# EAGLE design FreeLSSSMDBoard (EAGLE 6.6.0)
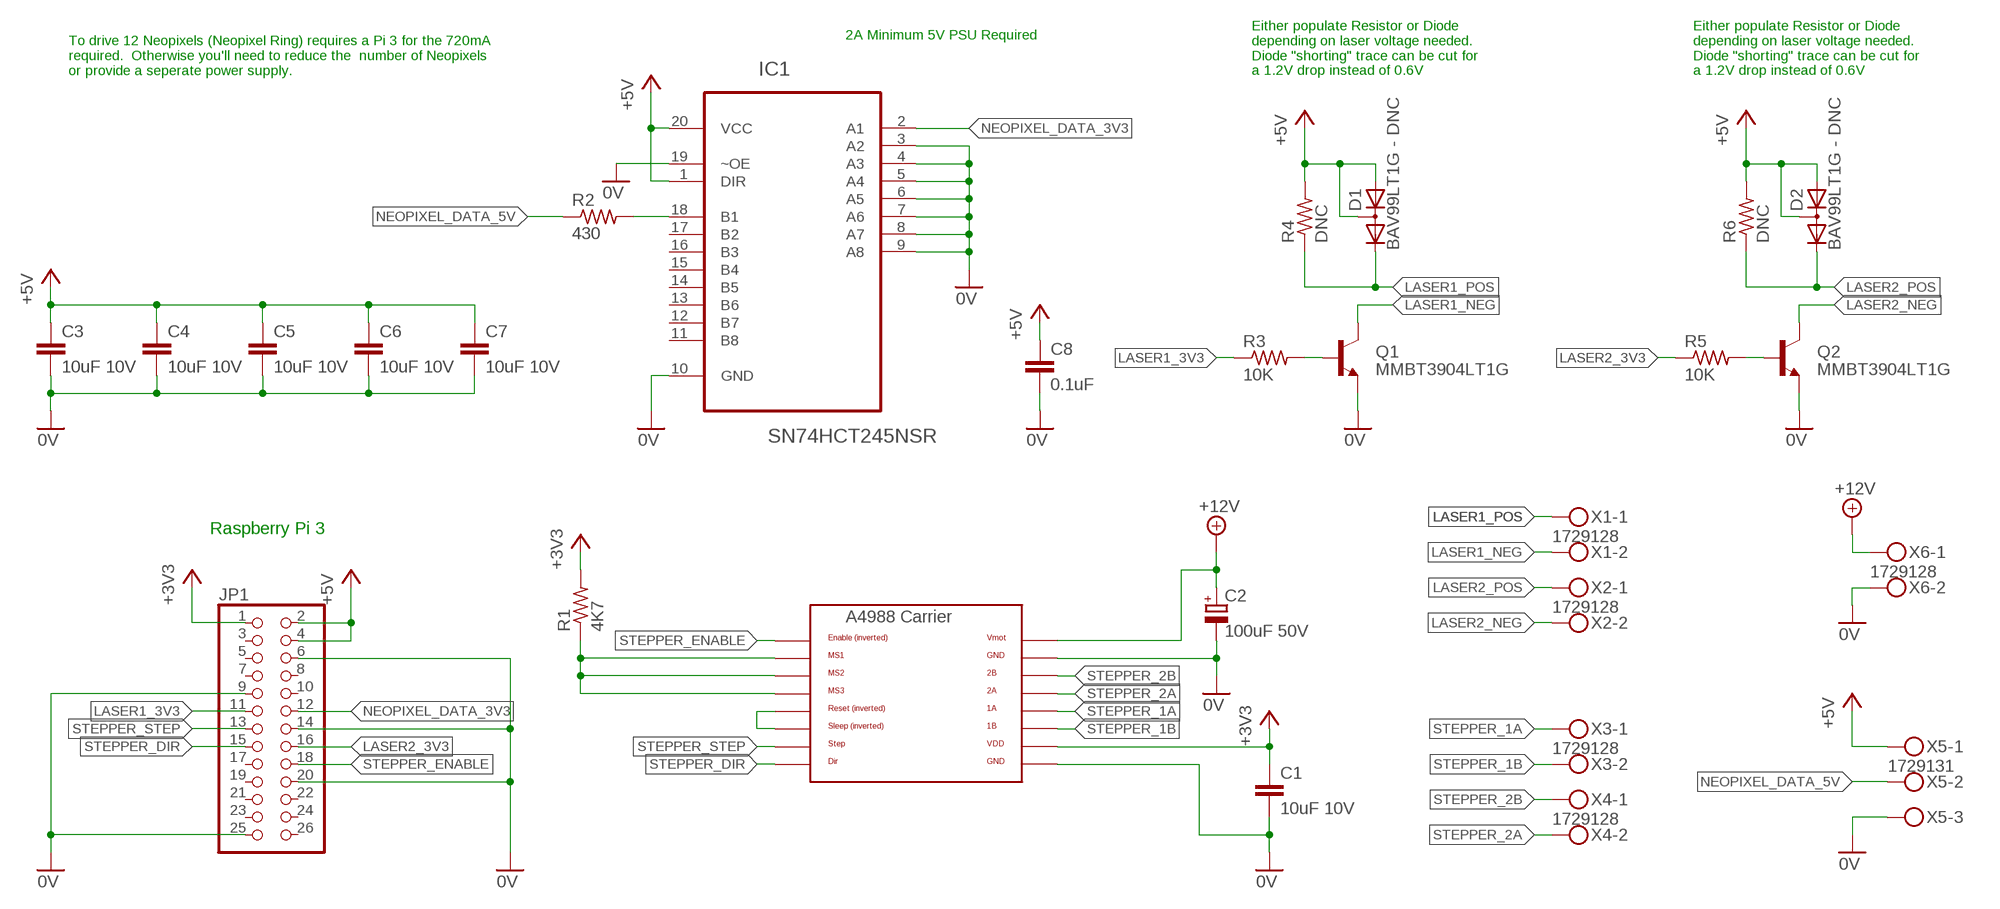
[diagram p0: schematic, sheet 1]

## Parts
C1  10uF 10V  C-EUC0603K  [C0603K]
C2  100uF 50V  CPOL-EUE3.5-8  [E3,5-8]
C3  10uF 10V  C-EUC0603K  [C0603K]
C4  10uF 10V  C-EUC0603K  [C0603K]
C5  10uF 10V  C-EUC0603K  [C0603K]
C6  10uF 10V  C-EUC0603K  [C0603K]
C7  10uF 10V  C-EUC0603K  [C0603K]
C8  0.1uF  C-EUC0603K  [C0603K]
D1  BAV99LT1G - DNC  BAV199  [SOT23]
D2  BAV99LT1G - DNC  BAV199  [SOT23]
IC1  SN74HCT245NSR  [SOP-20]
JP1  PINHD-2X13  [2X13]
Q1  MMBT3904LT1G  [SOT23-BEC]
Q2  MMBT3904LT1G  [SOT23-BEC]
R1  4K7  R-US_R0603  [R0603]
R2  430  R-US_R0603  [R0603]
R3  10K  R-US_R0603  [R0603]
R4  DNC  R-US_R0603  [R0603]
R5  10K  R-US_R0603  [R0603]
R6  DNC  R-US_R0603  [R0603]
U$1  A4988BREAKOUT  [A4988BREAKOUT]
X1  1729128  MKDSN1,5/2-5,08  [MKDSN1,5/2-5,08]
X2  1729128  MKDSN1,5/2-5,08  [MKDSN1,5/2-5,08]
X3  1729128  MKDSN1,5/2-5,08  [MKDSN1,5/2-5,08]
X4  1729128  MKDSN1,5/2-5,08  [MKDSN1,5/2-5,08]
X5  1729131  MKDSN1,5/3-5,08  [MKDSN1,5/3-5,08]
X6  1729128  MKDSN1,5/2-5,08  [MKDSN1,5/2-5,08]

## Nets
0V: C1.2 C2.- C3.2 C4.2 C5.2 C6.2 C7.2 C8.2 IC1.3(A2) IC1.4(A3) IC1.5(A4) IC1.6(A5) IC1.7(A6) IC1.8(A7) IC1.9(A8) IC1.10(GND) IC1.19(~OE) JP1.6 JP1.9 JP1.14 JP1.20 JP1.25 Q1.E Q2.E U$1.GND U$1.GND@0(GND) X5.3 X6.2
+3V3: C1.1 JP1.1 R1.2 U$1.VDD
+5V: C3.1 C4.1 C5.1 C6.1 C7.1 C8.1 D1.1(A) D1.3(AC) D2.1(A) D2.3(AC) IC1.1(DIR) IC1.20(VCC) JP1.2 JP1.4 R4.2 R6.2 X5.1
+12V: C2.+ U$1.VMOT X6.1
LASER1_3V3: JP1.11 R3.1
LASER1_NEG: Q1.C X1.2
LASER1_POS: D1.2(C) R4.1 X1.1
LASER2_3V3: JP1.16 R5.1
LASER2_NEG: Q2.C X2.2
LASER2_POS: D2.2(C) R6.1 X2.1
N$1: U$1.RST U$1.SLP(SLEEP)
N$2: R1.1 U$1.MS1 U$1.MS2 U$1.MS3
N$3: IC1.18(B1) R2.2
N$4: Q1.B R3.2
N$6: Q2.B R5.2
NEOPIXEL_DATA_3V3: IC1.2(A1) JP1.12
NEOPIXEL_DATA_5V: R2.1 X5.2
STEPPER_1A: U$1.1A X3.1
STEPPER_1B: U$1.1B X3.2
STEPPER_2A: U$1.2A X4.2
STEPPER_2B: U$1.2B X4.1
STEPPER_DIR: JP1.15 U$1.DIR
STEPPER_ENABLE: JP1.18 U$1.EN
STEPPER_STEP: JP1.13 U$1.STEP
Unconnected: IC1.11(B8) IC1.12(B7) IC1.13(B6) IC1.14(B5) IC1.15(B4) IC1.16(B3) IC1.17(B2) JP1.3 JP1.5 JP1.7 JP1.8 JP1.10 JP1.17 JP1.19 JP1.21 JP1.22 JP1.23 JP1.24 JP1.26

## Notes on the sheet
- 2A Minimum 5V PSU Required
- To drive 12 Neopixels (Neopixel Ring) requires a Pi 3 for the 720mA
  required.  Otherwise you'll need to reduce the  number of Neopixels
  or provide a seperate power supply.
- Either populate Resistor or Diode
  depending on laser voltage needed.
  Diode "shorting" trace can be cut for
  a 1.2V drop instead of 0.6V
- Either populate Resistor or Diode
  depending on laser voltage needed.
  Diode "shorting" trace can be cut for
  a 1.2V drop instead of 0.6V
- Raspberry Pi 3

## Library data of the parts
C1 C3-C8 = rcl:C-EU: CAPACITOR, European symbol
C2 = rcl:CPOL-EU: POLARIZED CAPACITOR, European symbol
D1 D2 = diode:BAV199: DIODE low-leakage double diode
IC1 = Jetty:SN74HCT245NSR: SN74HCT245NSR Octal Bus Transceivers with 3-State Outputs
JP1 = pinhead:PINHD-2X13: PIN HEADER
Q1 Q2 = 3at:MMBT3904LT1G
R1-R6 = rcl:R-US_: RESISTOR, American symbol
U$1 = RepRapjr:A4988BREAKOUT
X1-X4 X6 = con-phoenix-508:MKDSN1,5/2-5,08: MKDSN 1,5/ 2-5,08 Printklemme Nennstrom: 13,5 A Nennspannung: 250 V Rastermaß: 5,08 mm Polzahl: 2 Anschlussart: Schraubanschluss Montage: Löten Anschlussrichtung Leiter/Platine: 0 ° Artikelnummer: 1729128 Source: http://eshop.phoenixcontact.com .. 1729128.pdf
X5 = con-phoenix-508:MKDSN1,5/3-5,08: MKDSN 1,5/ 3-5,08 Printklemme Nennstrom: 13,5 A Nennspannung: 250 V Rastermaß: 5,08 mm Polzahl: 3 Anschlussart: Schraubanschluss Montage: Löten Anschlussrichtung Leiter/Platine: 0 ° Artikelnummer: 1729131 Source: http://eshop.phoenixcontact.com .. 1729131.pdf

## Board
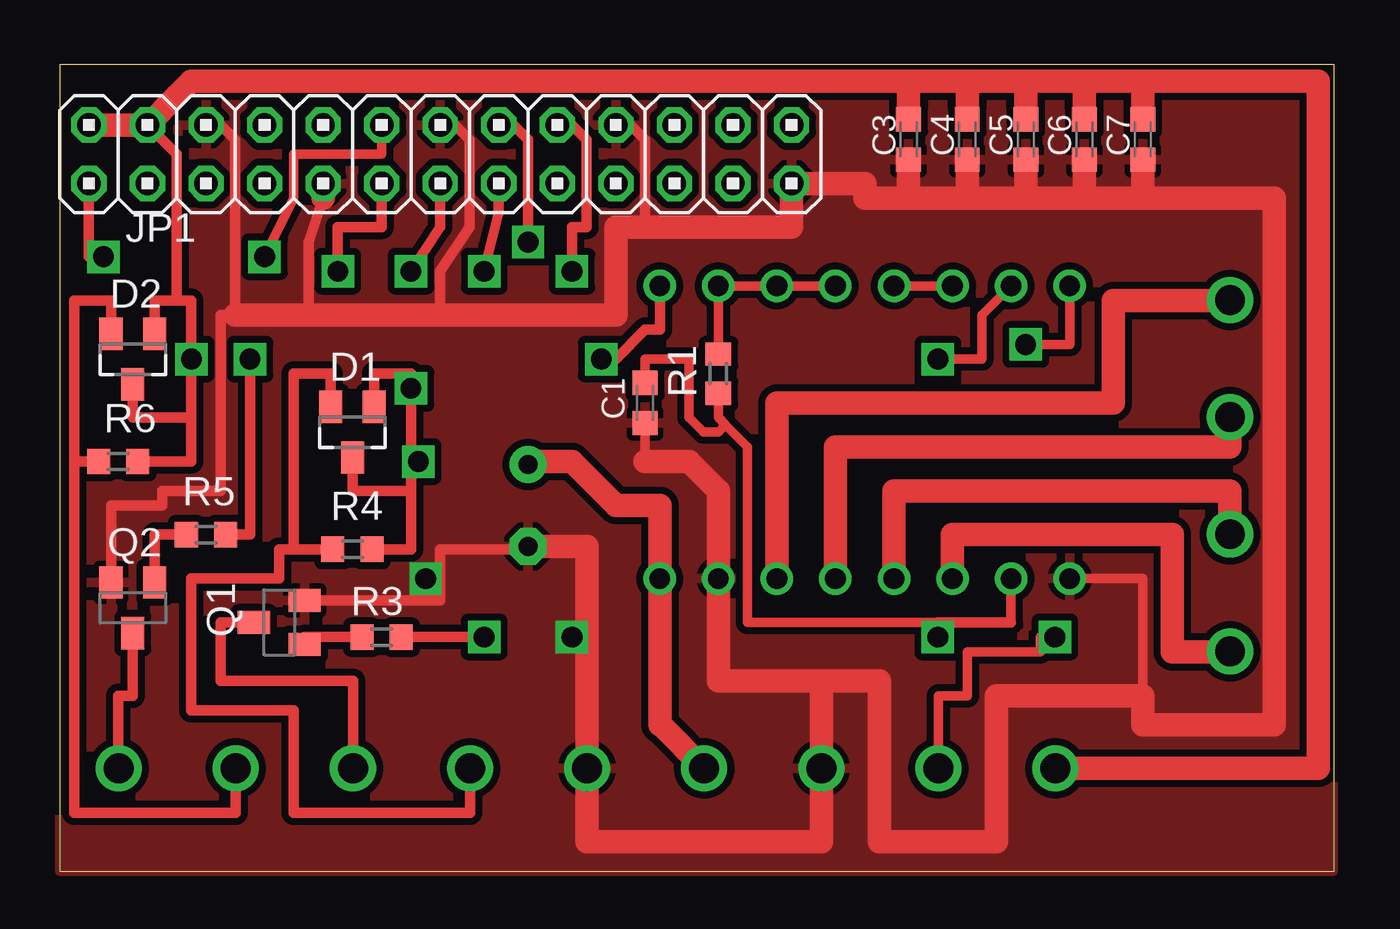
[diagram p1: board, top side]
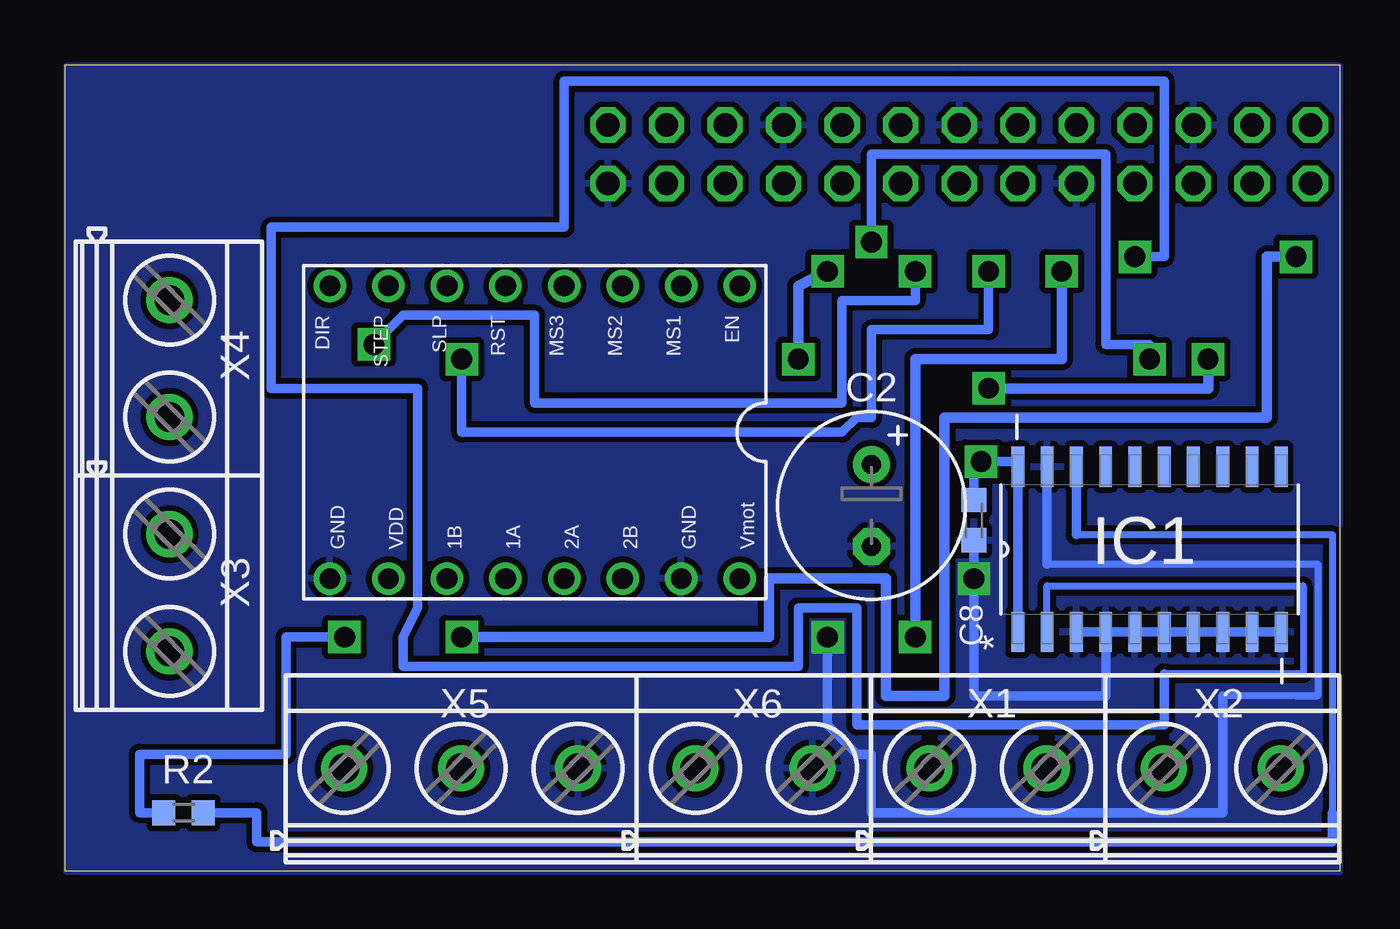
[diagram p2: board, bottom side, seen from below]

Size 55.3 x 35 mm. Coordinates in mm from the lower left corner, seen from the top.
Outline: 0,0 55.3,0 55.3,35 0,35 0,0
Copper layers (1*16): Top 0.035mm / dielectric 1.5mm / Bottom 0.035mm
Design rules "Othermill-DRC-1-100": minimum track width 8mil, minimum drill 0.8mm, track to track 0.256540625mm, track to pad 0.256540625mm, pad to pad 0.256540625mm, via to via 0.256540625mm, smd to smd 0mil, copper to edge 0mil, drill to drill 1mil, minimum pad ring 10mil, minimum via ring 10mil, stop-mask expansion 1mil, vias tented up to drill 30mil, thermal gap 10mil

### Footprints (pad centres in the part's own frame; a part is rotated, then mirrored left to right if it is on the bottom)
C0603K = smd 1.05 x 1.08: 1 -0.875,0; 2 0.875,0
E3,5-8 = drill 0.813 pad 1.6: + -1.778,0 | drill 0.813 pad 1.6 octagon: - 1.778,0
SOT23 = smd 1 x 1.4: 1 -0.95,-1.1; 2 0.95,-1.1; 3 0,1.1
SOP-20 = smd 1.753 x 0.559: 1 -3.581,5.715; 2 -3.581,4.445; 3 -3.581,3.175; 4 -3.581,1.905; 5 -3.581,0.635; 6 -3.581,-0.635; 7 -3.581,-1.905; 8 -3.581,-3.175; 9 -3.581,-4.445; 10 -3.581,-5.715; 11 3.581,-5.715; 12 3.581,-4.445; 13 3.581,-3.175; 14 3.581,-1.905; 15 3.581,-0.635; 16 3.581,0.635; 17 3.581,1.905; 18 3.581,3.175; 19 3.581,4.445; 20 3.581,5.715
2X13 = drill 1.016 octagon: 1 -15.24,-1.27; 2 -15.24,1.27; 3 -12.7,-1.27; 4 -12.7,1.27; 5 -10.16,-1.27; 6 -10.16,1.27; 7 -7.62,-1.27; 8 -7.62,1.27; 9 -5.08,-1.27; 10 -5.08,1.27; 11 -2.54,-1.27; 12 -2.54,1.27; 13 0,-1.27; 14 0,1.27; 15 2.54,-1.27; 16 2.54,1.27; 17 5.08,-1.27; 18 5.08,1.27; 19 7.62,-1.27; 20 7.62,1.27; 21 10.16,-1.27; 22 10.16,1.27; 23 12.7,-1.27; 24 12.7,1.27; 25 15.24,-1.27; 26 15.24,1.27
SOT23-BEC = smd 1 x 1.4: B -0.95,-1.1; C 0,1.1; E 0.95,-1.1
R0603 = smd 1 x 1.1: 1 -0.85,0; 2 0.85,0
A4988BREAKOUT = drill 0.9: 1A 8.89,1.27; 1B 11.43,1.27; 2A 6.35,1.27; 2B 3.81,1.27; DIR 16.51,-11.43; EN -1.27,-11.43; GND 16.51,1.27; GND@0 1.27,1.27; MS1 1.27,-11.43; MS2 3.81,-11.43; MS3 6.35,-11.43; RST 8.89,-11.43; SLP 11.43,-11.43; STEP 13.97,-11.43; VDD 13.97,1.27; VMOT -1.27,1.27
MKDSN1,5/2-5,08 = drill 1.3 pad 2: 1 -2.561,0.025; 2 2.519,0.025
MKDSN1,5/3-5,08 = drill 1.3 pad 2: 1 -7.641,0.025; 2 -2.561,0.025; 3 2.519,0.025

### Placement (x,y rotation side)
C1  25.4,20.32 270 top
C2  20.32,15.88 270 bottom
C3  36.83,31.75 270 top
C4  39.37,31.75 270 top
C5  41.91,31.75 270 top
C6  44.45,31.75 270 top
C7  46.99,31.75 270 top
C8  15.88,15.24 270 bottom
D1  12.7,19.05 180 top
D2  3.17,22.23 180 top
IC1  8.26,13.97 90 bottom
JP1  16.51,31.11 0 top
Q1  9.53,10.79 90 top
Q2  3.17,11.43 180 top
R1  28.57,21.59 270 top
R2  50.16,2.54 0 bottom
R3  13.97,10.16 180 top
R4  12.7,13.97 0 top
R5  6.35,14.61 180 top
R6  2.54,17.78 0 top
U$1  27.3,13.97 180 bottom
X1  15.24,4.45 0 bottom
X2  5.08,4.45 0 bottom
X3  50.8,12.06 270 bottom
X4  50.8,22.23 270 bottom
X5  35.56,4.45 0 bottom
X6  25.4,4.45 0 bottom

### Tracks (layer width: path | path; a pad name or v marks a point on that pad's centre or on a via)
0V  (via drill 0.9 pad 0.61)
  Top 0.406: U$1.GND 46.99,12.7 46.99,10.79 46.99,7.62 43.81,7.62 | C1.2 25.4,17.78 | 11.43,29.21 10.79,27.3 10.79,24.13 | v15.88,12.7 16.51,12.7 | v22.23,10.16 22.88,10.16
  Top 0.457: JP1.6 6.99,32.38 7.62,31.75 7.62,24.13 6.99,24.13 6.99,16.51 5.08,16.51 4.45,16.51 4.45,15.88 2.23,15.88 Q2.E | JP1.14 17.14,32.38 17.78,31.75 17.78,27.94 16.51,26.04 16.51,24.13 17.78,24.13 | JP1.20 24.77,32.38 25.4,31.75 25.4,27.94 | JP1.9 11.43,29.21 10.79,27.3 10.79,24.13 | Q1.E 16.51,11.74 16.51,12.7 16.51,13.97 20.32,13.97 C2.-
  Top 1.016: C2.- 22.88,14.1 22.88,10.16 X6.2 22.88,1.27 30.48,1.27 33.04,1.27 X5.3 33.04,8.26 | 33.04,8.26 33.02,8.26 30.48,8.26 28.57,8.26 U$1.GND@0 28.57,16.51 27.3,17.78 25.4,17.78 | 44.45,29.21 C6.2 44.45,29.21 | 44.45,29.21 46.35,29.21 | 46.35,29.21 46.99,29.21 C7.2 | 44.45,29.21 41.91,29.21 | 41.91,29.21 C5.2 41.91,29.21 | 41.91,29.21 39.37,29.21 | 39.37,29.21 C4.2 39.37,29.21 | 39.37,29.21 36.83,29.21 | 36.83,29.21 C3.2 36.83,29.21 | 36.83,29.21 34.92,29.21 34.92,29.84 JP1.25 31.75,27.94 25.4,27.94 24.13,27.94 24.13,24.13 17.78,24.13 10.79,24.13 7.62,24.13 | 33.04,8.26 35.56,8.26 35.56,1.27 40.64,1.27 40.64,7.62 43.81,7.62 46.99,7.62 46.99,6.35 52.7,6.35 52.7,29.21 46.35,29.21 | JP1.9 11.43,29.21
  Bottom 0.305: 12.7,13.34 0.95,13.34 0.95,7.62 | 1.91,7.62 0.95,7.62 | 0.95,7.62 1.91,7.62 | 1.91,7.62 5.08,7.62
  Bottom 0.406: IC1.4 IC1.5 IC1.6 IC1.7 IC1.8 IC1.9 IC1.10 | v15.88,12.7 C8.2 v15.88,12.7 | v15.88,12.7 15.88,7.62 10.16,7.62 IC1.4 | IC1.19 12.7,13.34 | 5.08,7.62 5.08,2.54 20.32,2.54 20.32,5.08 20.95,5.08 22.23,6.35 v22.23,10.16 | IC1.3 IC1.4
  pour Top (isolate 0.305): 0,0 0,34.92 55.24,34.92 55.24,0
  pour Bottom: 0,0 0,34.92 55.24,34.92 55.24,0
+3V3  (via drill 0.9 pad 0.61)
  Top 0.406: U$1.VDD 41.27,10.79 | R1.2 28.57,19.68 28.89,19.37 | 28.89,19.37 29.84,18.41 29.84,15.88 29.84,11.43 29.84,10.79 38.1,10.79 | C1.1 25.4,22.23 26.67,22.23 27.3,22.23 27.3,19.68 27.94,19.05 28.57,19.05 28.89,19.37
  Top 0.457: JP1.1 1.27,27.94 1.27,26.67 v1.91,26.67 | 41.27,10.79 38.1,10.79 v38.1,10.16
  Bottom 0.457: v38.1,10.16 24.77,10.16 24.77,12.7 19.68,12.7 19.68,7.62 17.14,7.62 17.14,19.68 3.17,19.68 3.17,26.67 v1.91,26.67
+5V  (via drill 0.9 pad 0.61)
  Top 0.406: 15.24,13.97 15.24,17.78 v15.56,17.78
  Top 0.457: R6.2 5.71,17.78 | 5.71,17.78 5.71,19.68 | 5.71,19.68 5.71,20.32 | 5.71,20.32 5.71,24.77 5.08,24.77 | 5.08,24.77 4.12,24.77 D2.1 | D2.3 3.17,19.68 5.71,19.68 | 5.71,19.68 v5.71,22.23 | v5.71,22.23 5.71,19.68 | 5.71,19.68 5.71,20.32 | JP1.4 5.08,31.11 5.08,25.4 5.08,24.77 | 12.7,16.51 D1.3 12.7,16.51 | 12.7,16.51 15.24,16.51 | 15.24,16.51 15.24,17.78 | 15.24,17.78 15.24,19.05 15.24,19.68 | 15.24,19.68 v15.24,20.95 | v15.24,20.95 15.24,19.68 | 15.24,19.68 15.24,21.59 13.65,21.59 D1.1 | R4.2 15.24,13.97 15.24,16.51 | 12.7,16.51 15.24,16.51 | 15.24,16.51 15.24,17.78 | 15.24,17.78 15.24,19.68 | 15.24,19.68 v15.24,20.95 | 5.71,17.78 5.71,19.68 | 5.71,19.68 v5.71,22.23
  Top 1.016: 46.99,34.29 54.61,34.29 54.61,32.38 54.61,28.57 54.61,4.47 X5.1 | 46.99,34.29 C7.1 | C6.1 44.45,34.29 | 44.45,34.29 46.99,34.29 | C5.1 41.91,34.29 | 41.91,34.29 44.45,34.29 | 39.37,34.29 C4.1 39.37,34.29 | 39.37,34.29 41.91,34.29 | 39.37,34.29 36.83,34.29 | 36.83,34.29 C3.1 | JP1.2 JP1.4 5.08,33.66 5.71,34.29 36.83,34.29
  Bottom 0.406: IC1.20 13.97,17.78 | 13.97,17.78 IC1.1 | C8.1 15.88,17.78 | 15.88,17.78 13.97,17.78 | v15.56,17.78 15.88,17.78
  Bottom 0.457: v5.71,22.23 5.71,20.95 v15.24,20.95
+12V
  Top 1.016: X6.1 26.08,6.35 26.04,6.35 U$1.VMOT 26.04,15.88 24.13,15.88 22.23,17.78 20.45,17.78 C2.+
LASER1_3V3  (via drill 0.9 pad 0.61)
  Top 0.457: JP1.11 13.97,27.94 12.06,27.94 v12.06,26.04 | R3.1 v18.41,10.16
  Bottom 0.457: v18.41,10.16 18.41,20.95 18.41,21.59 18.41,22.23 13.97,22.23 12.06,22.23 v12.06,26.04
LASER1_NEG
  Top 0.457: Q1.C 6.99,10.79 6.99,8.26 12.72,8.26 X1.2
LASER1_POS
  Top 0.457: 10.16,13.97 R4.1 10.16,13.97 | 10.16,13.97 9.53,13.97 9.53,12.7 5.71,12.7 5.71,6.99 10.16,6.99 10.16,2.54 17.8,2.54 X1.1 | 10.16,13.97 10.16,21.59 11.75,21.59 D1.2
LASER2_3V3  (via drill 0.9 pad 0.61)
  Top 0.406: 20.32,27.94 v20.32,27.3 | v8.26,22.23 8.26,21.59
  Top 0.457: JP1.16 19.68,32.38 20.32,31.75 20.32,27.94 | R5.1 8.26,14.61 8.26,17.78 8.26,21.59 v8.26,22.23
  Bottom 0.406: v20.32,27.3 20.32,31.11 10.16,31.11 10.16,22.86 8.26,22.86 v8.26,22.23
LASER2_NEG
  Top 0.457: 1.91,4.47 X2.2 2.54,4.47 2.54,7.62 3.17,7.62 Q2.C
LASER2_POS
  Top 0.457: 0.64,17.78 R6.1 0.64,17.78 | 0.64,17.78 0.64,2.54 7.64,2.54 X2.1 | 0.64,17.78 0.64,19.68 0.64,24.77 2.23,24.77 D2.2
N$1
  Top 0.406: U$1.RST U$1.SLP
N$2
  Top 0.406: U$1.MS3 U$1.MS2 U$1.MS1 R1.1
N$3
  Bottom 0.305: 11.43,14.61 0.64,14.61 0.32,14.61 0.32,2.54
  Bottom 0.406: IC1.18 11.43,14.61 | R2.2 46.99,2.54 46.99,1.27 0.32,1.27 0.32,2.54
N$4
  Top 0.457: R3.2 12.06,10.16 10.62,10.16 Q1.B
N$6
  Top 0.457: R5.2 4.12,14.61 Q2.B
NEOPIXEL_DATA_3V3  (via drill 0.9 pad 0.61)
  Top 0.406: v8.89,26.67 10.16,29.21 10.16,30.8 10.16,31.11 13.97,31.11 JP1.12
  Bottom 0.305: IC1.2 12.7,12.38 1.59,12.38 1.59,8.57 7.62,8.57
  Bottom 0.406: 7.62,8.57 7.62,6.67 7.62,6.35 20.95,6.35 20.95,11.43 23.5,11.43 23.5,8.89 36.83,8.89 38.1,8.89 40.64,8.89 40.64,10.16 40.01,11.43 40.01,20.95 46.35,20.95 46.35,27.94 33.66,27.94 33.66,33.66 33.66,34.29 16.51,34.29 7.62,34.29 7.62,26.67 v8.89,26.67
NEOPIXEL_DATA_5V  (via drill 0.9 pad 0.61)
  Top 0.406: v43.18,10.16 42.55,10.16 42.55,9.53 39.37,9.53 39.37,7.62 38.12,7.62 X5.2
  Bottom 0.406: R2.1 52.07,2.54 52.07,5.08 45.72,5.08 45.72,10.16 v43.18,10.16
STEPPER_1A
  Top 1.016: U$1.1A 36.2,16.51 44.45,16.51 50.77,16.51 X3.1
STEPPER_1B
  Top 1.016: U$1.1B 38.73,14.61 44.45,14.61 48.26,14.61 48.26,9.53 50.77,9.53 X3.2
STEPPER_2A
  Top 1.016: U$1.2A 33.66,17.78 33.66,18.41 44.45,18.41 50.77,18.41 X4.2
STEPPER_2B
  Top 1.016: U$1.2B 31.11,20.32 44.45,20.32 45.72,20.32 45.72,24.77 50.77,24.77 X4.1
STEPPER_DIR  (via drill 0.9 pad 0.61)
  Top 0.406: 19.05,28.57 v18.41,26.04 | v41.91,22.86 43.81,22.86 U$1.DIR
  Top 0.457: JP1.15 19.05,28.57
  Bottom 0.406: v18.41,26.04 18.41,24.77 21.59,24.77 21.59,20.32 34.92,20.32 34.92,24.13 40.64,24.13 v41.91,22.86
STEPPER_ENABLE  (via drill 0.9 pad 0.61)
  Top 0.457: JP1.18 22.23,32.38 22.86,31.75 22.86,27.94 22.23,27.94 v22.23,26.04 | U$1.EN 26.04,23.5 25.4,23.5 24.13,22.23 v23.5,22.23
  Bottom 0.457: v23.5,22.23 23.5,25.4 v22.23,26.04
STEPPER_STEP  (via drill 0.9 pad 0.61)
  Top 0.406: 16.51,27.94 v15.24,26.04 | v38.1,22.23 40.01,22.23 40.01,23.5 40.01,24.13 U$1.STEP
  Top 0.457: JP1.13 16.51,27.94
  Bottom 0.406: v15.24,26.04 15.24,23.5 20.32,23.5 20.32,19.68 20.95,19.68 21.59,19.05 38.1,19.05 v38.1,22.23

### Text on the board
tDocu: * | 2B | 2A | 1A | Stepper | 1B | NEG | POS | NEG | POS | 0V | +12V | 0V | Data | +5V | Laser 2 | Laser 1 | StepperPwr | Neopixel